# Altium project HealthWatcher_PCB_Project_1.PrjPcb
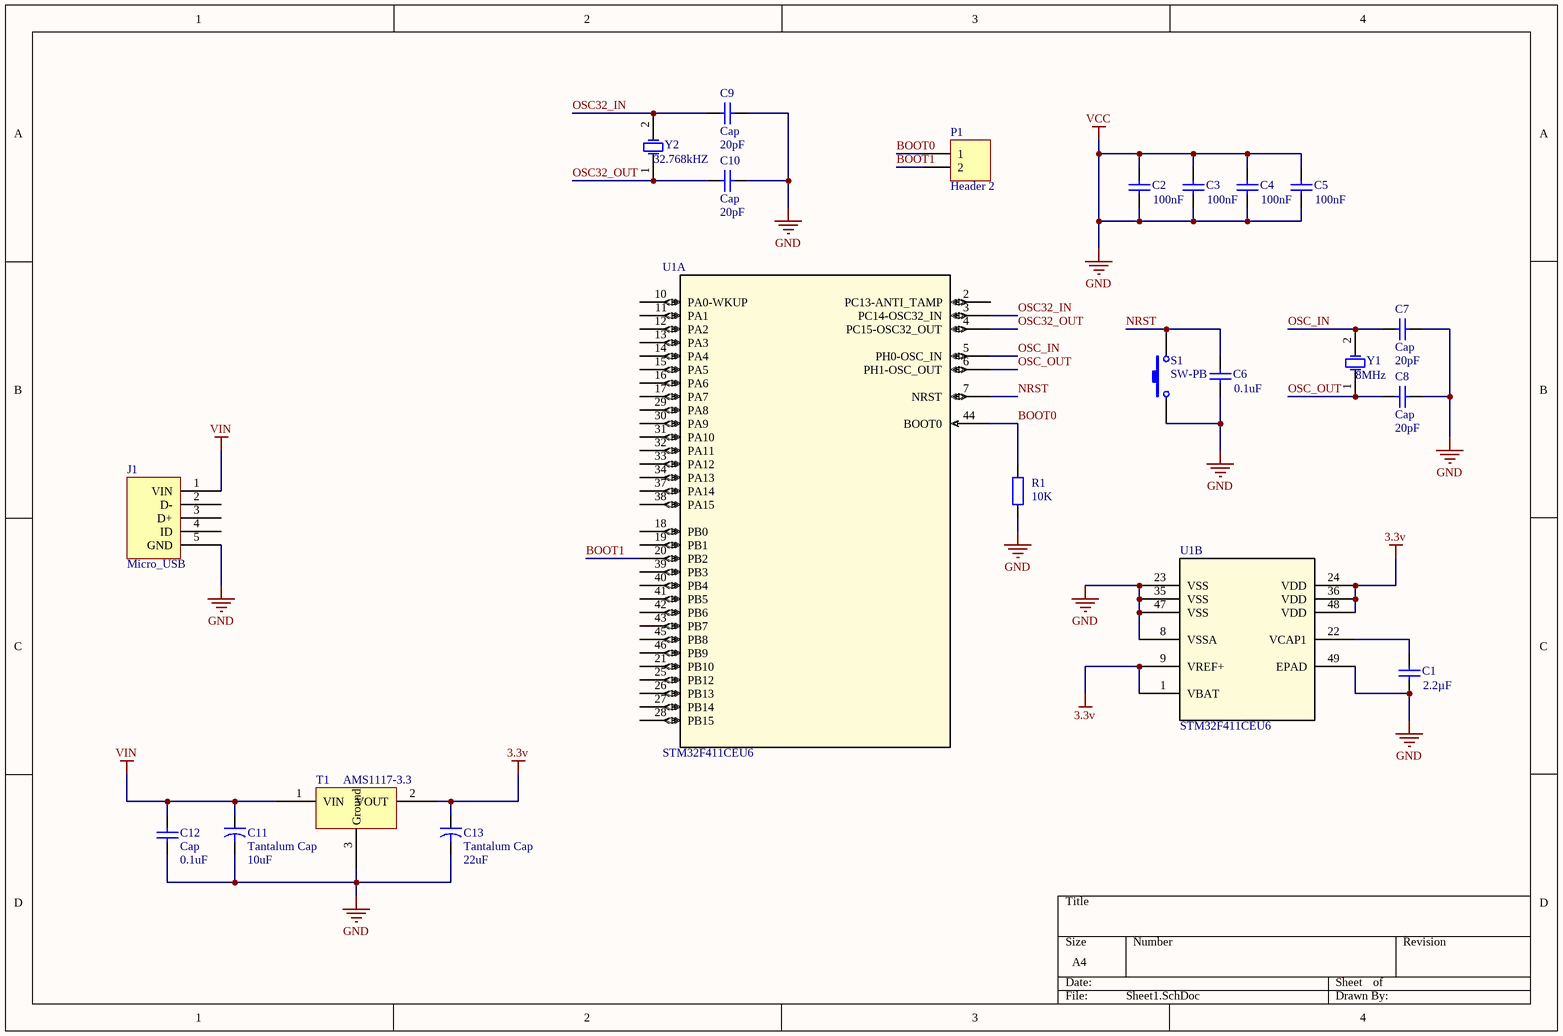
[diagram p0: Sheet1.SchDoc]
1 sheet, 21 parts. Net scope: global (net labels, ports and power ports of the same name join across sheets).

## Sheet Sheet1.SchDoc
size A4

### Parts
C1  value 2.2µF  [RAD-0.3]  (hidden comment: Cap)
C2  value 100nF  [RAD-0.3]  (hidden comment: Cap)
C3  value 100nF  [RAD-0.3]  (hidden comment: Cap)
C4  value 100nF  [RAD-0.3]  (hidden comment: Cap)
C5  value 100nF  [RAD-0.3]  (hidden comment: Cap)
C6  value 0.1uF  [RAD-0.3]  (hidden comment: Cap)
C7  Cap  value 20pF  [RAD-0.3]
C8  Cap  value 20pF  [RAD-0.3]
C9  Cap  value 20pF  [RAD-0.3]
C10  Cap  value 20pF  [RAD-0.3]
C11  Tantalum Cap  value 10uF  [CAPR5-4X5]
C12  Cap  value 0.1uF  [RAD-0.3]
C13  Tantalum Cap  value 22uF  [CAPR5-4X5]
J1  Micro_USB
P1  Header 2  [HDR1X2]
R1  value 10K  [AXIAL-0.4]  (hidden comment: Res2)
S1  SW-PB  [SPST-2]
T1  AMS1117-3.3
U1  STM32F411CEU6  [UFQFPN-48_7X7X0P55MM]  (parts A,B of 2)
Y1  value 8MHz  [R38]  (hidden comment: XTAL)
Y2  value 32.768kHZ  [R38]  (hidden comment: XTAL)

### Nets
3.3v: C13.1 T1.2(VOUT) U1.1(VBAT) U1.9(VREF+) U1.24(VDD) U1.36(VDD) U1.48(VDD)
GND: C1.1 C2.1 C2.2 C3.1 C3.2 C4.1 C4.2 C5.1 C5.2 C6.1 C7.2 C8.2 C9.2 C10.2 C11.2 C12.1 C13.2 J1.5(GND) R1.1 S1.1 T1.3(Ground) U1.8(VSSA) U1.23(VSS) U1.35(VSS) U1.47(VSS) U1.49(EPAD)  [also labelled VCC]
VIN: C11.1 C12.2 J1.1(VIN) T1.1(VIN)
BOOT0: P1.1 R1.2 U1.44(BOOT0)
BOOT1: P1.2 U1.20(PB2)
NRST: C6.2 S1.2 U1.7(NRST)
OSC32_IN: C9.1 U1.3(PC14-OSC32_IN) Y2.2(OSC2)
OSC32_OUT: C10.1 U1.4(PC15-OSC32_OUT) Y2.1(OSC1)
OSC_IN: C7.1 U1.5(PH0-OSC_IN) Y1.2(OSC2)
OSC_OUT: C8.1 U1.6(PH1-OSC_OUT) Y1.1(OSC1)
NetC1_2: C1.2 U1.22(VCAP1)

Not connected (* = marked no-connect by the designer): J1 2(D-) 3(D+) 4(ID); U1 2(PC13-ANTI_TAMP) 10(PA0-WKUP) 11(PA1) 12(PA2) 13(PA3) 14(PA4) 15(PA5) 16(PA6) 17(PA7) 18(PB0) 19(PB1) 21(PB10) 25(PB12) 26(PB13) 27(PB14) 28(PB15) 29(PA8) 30(PA9) 31(PA10) 32(PA11) 33(PA12) 34(PA13) 37(PA14) 38(PA15) 39(PB3) 40(PB4) 41(PB5) 42(PB6) 43(PB7) 45(PB8) 46(PB9)

### Library data of the parts
C1-C10 C12 = Cap: Capacitor; Published: 8-Jun-2000; LatestRevisionDate: 17-Jul-2002; LatestRevisionNote: Re-released for DXP Platform.; PackageReference: RAD-0.3; Publisher: Altium Limited; PackageDescription: Radial Cap, Thru-Hole; 2 Leads; 0.3 in Pin Spacing
C11 C13 = Cap2: Capacitor; Published: 23-Sep-2002; PackageReference: CAPR5-4X5; Publisher: Altium Limited; PackageDescription: Capacitor; 2 Leads
P1 = Header 2: Header, 2-Pin; LatestRevisionDate: 17-Jul-2002; LatestRevisionNote: Re-released for DXP Platform.; Publisher: Altium Limited
R1 = Res2: Resistor; Published: 8-Jun-2000; LatestRevisionDate: 17-Jul-2002; LatestRevisionNote: Re-released for DXP Platform.; PackageReference: AXIAL-0.4; Publisher: Altium Limited; PackageDescription: Axial Device, Thru-Hole; 2 Leads; 0.4 in Pin Spacing
S1 = SW-PB: Switch; Published: 24-Mar-1999; LatestRevisionDate: 17-Jul-2002; LatestRevisionNote: Re-released for DXP Platform.; PackageReference: SPST-2; Publisher: Altium Limited; PackageDescription: Switch; 2 Leads
U1 = STM32F411CEU6: No Description Available; Mfr_Name: STMicroelectronics; Copyright: Copyright (C) 2021 Ultra Librarian. All rights reserved.; Manufacturer_Part_Number: STM32F411CEU6; RefDes: RefDes; Type: DEV
Y1 Y2 = XTAL: Crystal Oscillator; Published: 8-Jun-2000; LatestRevisionDate: 17-Jul-2002; LatestRevisionNote: Re-released for DXP Platform.; PackageReference: R38; Publisher: Altium Limited; PackageDescription: Crystal, Thru-Hole; 2 Leads; Body 3.1 x 8.2 mm (Dia.xH)